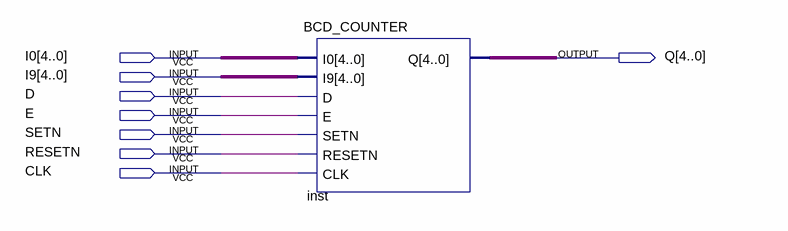
[diagram p0: schematic sheet]
// Quartus schematic TOP.bdf as structural Verilog: 1 symbols, 8 pins
module TOP (
  input  [4:0] I0,
  input  [4:0] I9,
  input  D,
  input  E,
  input  SETN,
  input  RESETN,
  input  CLK,
  output [4:0] Q
);

  BCD_COUNTER inst (.I0(I0), .I9(I9), .D(D), .E(E), .SETN(SETN), .RESETN(RESETN), .CLK(CLK), .Q(Q));
endmodule
